# Altium schematic sheet CoverPage.SchDoc: Cover Page
size A4; DrawnBy: Trevor Charmley; DocumentNumber: 1; Revision: 1; SheetNumber: 1; SheetTotal: 8
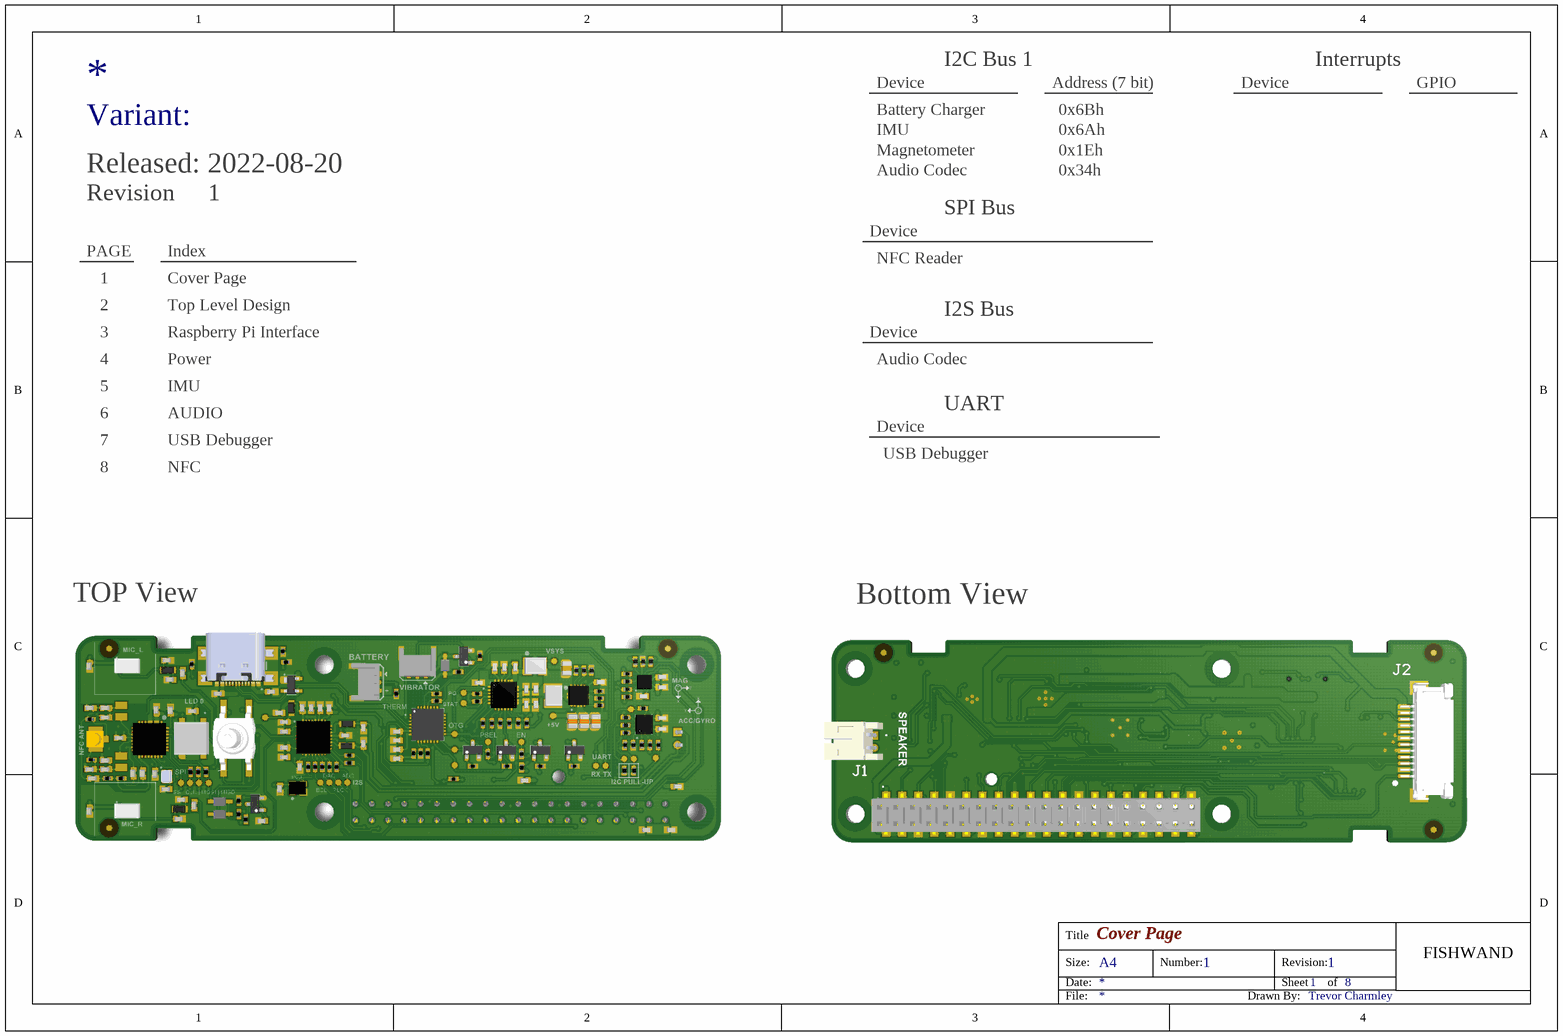
[diagram p0: CoverPage.SchDoc]

## Notes on the sheet
- Device
- Battery Charger
- I2C Bus 1
- Address (7 bit)
- 0x6Bh
- Interrupts
- GPIO
- Variant:
- Released: 2022-08-20
- IMU
- Magnetometer
- Audio Codec
- 0x6Ah
- 0x1Eh
- 0x34h
- Revision
- SPI Bus
- PAGE
- 1
- 2
- Index
- Cover Page
- Top Level Design
- NFC Reader
- 3
- 4
- Raspberry Pi Interface
- Power
- I2S Bus
- 5
- 6
- 7
- AUDIO
- USB Debugger
- UART
- 8
- NFC
- TOP View
- Bottom View
- Title
- Size:
- Date:
- A4
- Number:
- Revision:
- Sheet
- of
- FISHWAND
- File:
- Drawn By: